# Altium schematic sheet Schematic_3.SchDoc
size A3
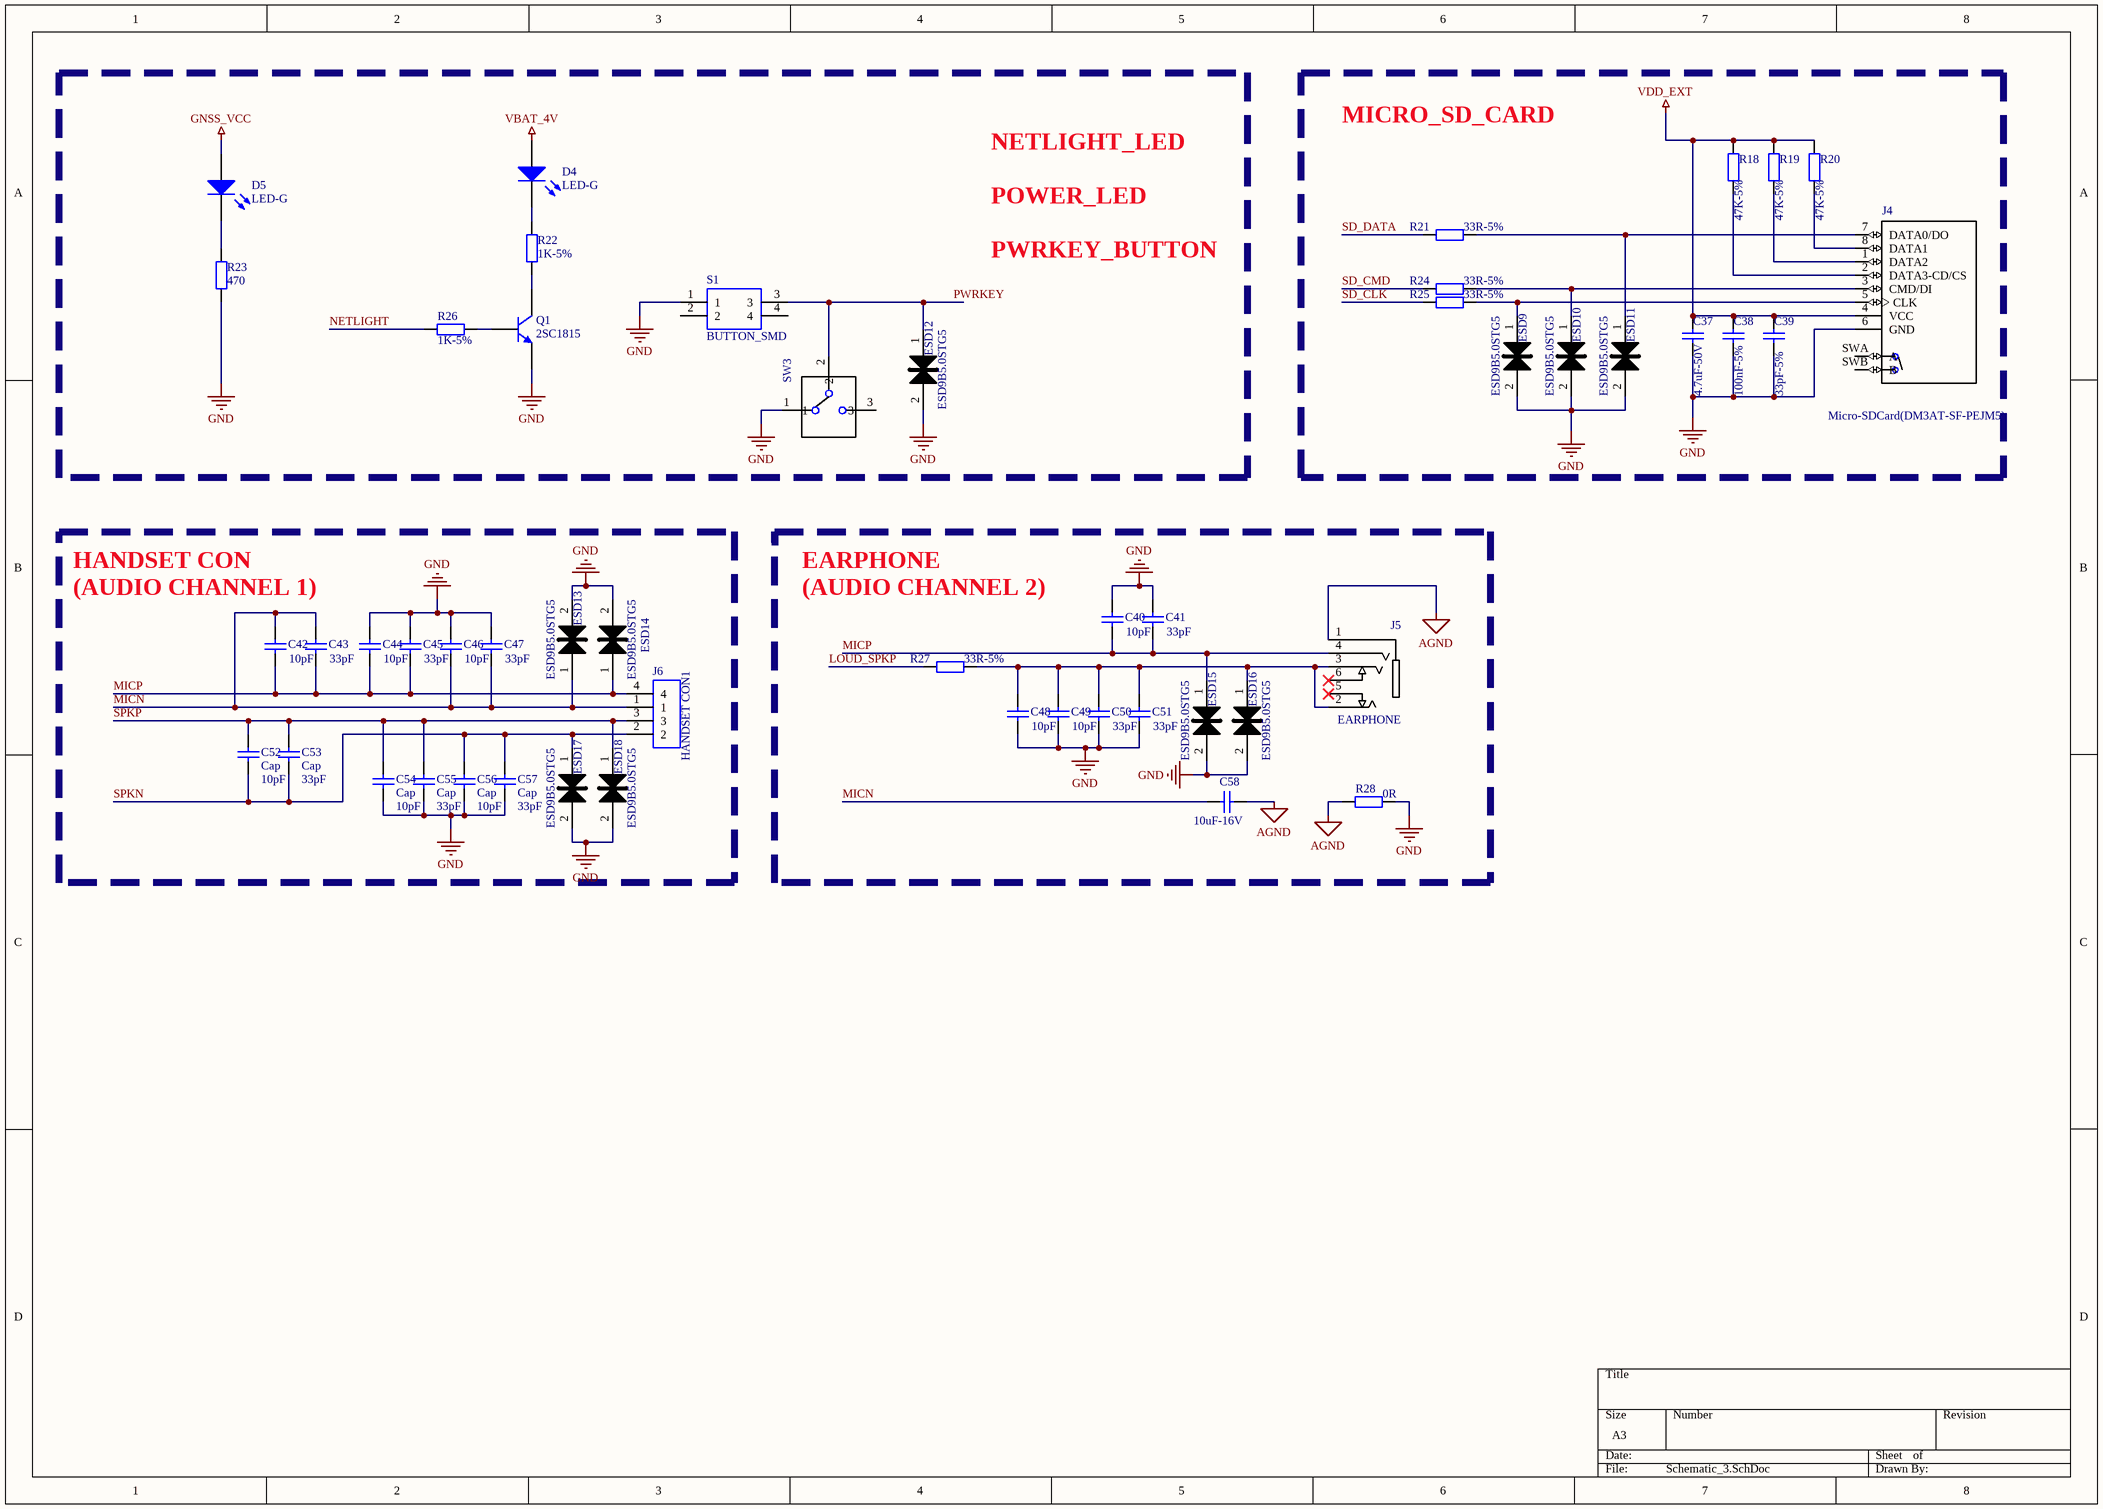
[diagram p0: Schematic_3.SchDoc]

## Parts
C37  value 4.7uF-50V  [C0805]  (hidden comment: Cap)
C38  value 100nF-5%  [C0805]  (hidden comment: Cap)
C39  value 33pF-5%  [C0805]  (hidden comment: Cap)
C40  value 10pF  [C0805]  (hidden comment: Cap)
C41  value 33pF  [C0805]  (hidden comment: Cap)
C42  value 10pF  [C0805]  (hidden comment: Cap)
C43  value 33pF  [C0805]  (hidden comment: Cap)
C44  value 10pF  [C0805]  (hidden comment: Cap)
C45  value 33pF  [C0805]  (hidden comment: Cap)
C46  value 10pF  [C0805]  (hidden comment: Cap)
C47  value 33pF  [C0805]  (hidden comment: Cap)
C48  value 10pF  [C0805]  (hidden comment: Cap)
C49  value 10pF  [C0805]  (hidden comment: Cap)
C50  value 33pF  [C0805]  (hidden comment: Cap)
C51  value 33pF  [C0805]  (hidden comment: Cap)
C52  Cap  value 10pF  [C0805]
C53  Cap  value 33pF  [C0805]
C54  Cap  value 10pF  [C0805]
C55  Cap  value 33pF  [C0805]
C56  Cap  value 10pF  [C0805]
C57  Cap  value 33pF  [C0805]
C58  value 10uF-16V  [C0805]  (hidden comment: Cap)
D4  LED-G  [6-0805_L]
D5  LED-G  [6-0805_L]
ESD9  ESD9B5.0STG5  [ESD9B5.0STG5]
ESD10  ESD9B5.0STG5  [ESD9B5.0STG5]
ESD11  ESD9B5.0STG5  [ESD9B5.0STG5]
ESD12  ESD9B5.0STG5  [ESD9B5.0STG5]
ESD13  ESD9B5.0STG5  [ESD9B5.0STG5]
ESD14  ESD9B5.0STG5  [ESD9B5.0STG5]
ESD15  ESD9B5.0STG5  [ESD9B5.0STG5]
ESD16  ESD9B5.0STG5  [ESD9B5.0STG5]
ESD17  ESD9B5.0STG5  [ESD9B5.0STG5]
ESD18  ESD9B5.0STG5  [ESD9B5.0STG5]
J4  Micro-SDCard(DM3AT-SF-PEJM5)  [SD_CARD]
J5  EARPHONE  [Audio_Jack]
J6  HANDSET CON1  [RJ11-HANDSETCON]
Q1  2SC1815  [SOT23_L]
R18  value 47K-5%  [6-0805_L]  (hidden comment: Res2)
R19  value 47K-5%  [6-0805_L]  (hidden comment: Res2)
R20  value 47K-5%  [6-0805_L]  (hidden comment: Res2)
R21  value 33R-5%  [6-0805_L]  (hidden comment: Res2)
R22  value 1K-5%  [6-0805_L]  (hidden comment: Res2)
R23  value 470  [6-0805_L]  (hidden comment: Res2)
R24  value 33R-5%  [6-0805_L]  (hidden comment: Res2)
R25  value 33R-5%  [6-0805_L]  (hidden comment: Res2)
R26  value 1K-5%  [6-0805_L]  (hidden comment: Res2)
R27  value 33R-5%  [6-0805_L]  (hidden comment: Res2)
R28  value 0R  [6-0805_L]  (hidden comment: Res2)
S1  BUTTON_SMD  [BUTTON_4PINS_SMD_3D]
SW3  DIP-SLIDE-SWITCH(3P-11.6X4.0X5.4+2.0MM)  [SLIDE_SWITCH_3PINS]  (value not drawn)

## Nets
AGND: C58.2 J5.1(SLEEVE) R28.1
GND: C37.1 C38.1 C39.2 C40.1 C41.1 C44.2 C45.2 C46.2 C47.2 C48.1 C49.1 C50.1 C51.1 C54.1 C55.1 C56.1 C57.1 ESD9.2(K) ESD10.2(K) ESD11.2(K) ESD12.2(K) ESD13.2(K) ESD14.2(K) ESD15.2(K) ESD16.2(K) ESD17.2(K) ESD18.2(K) J4.6(GND) Q1.1(E) R23.2 R28.2 S1.1 SW3.1
GNSS_VCC: D5.1(A)
VBAT_4V: D4.1(A)
VDD_EXT: C37.2 C38.2 C39.1 J4.4(VCC) R18.2 R19.2 R20.2
LOUD_SPKP: R27.1
MICN: C42.2 C43.2 C46.1 C47.1 C58.1 ESD13.1(A) J6.1
MICP: C40.2 C41.2 C42.1 C43.1 C44.1 C45.1 ESD14.1(A) ESD15.1(A) J5.4(RING2) J6.4
NETLIGHT: R26.2
PWRKEY: ESD12.1(A) S1.3 SW3.2
SD_CLK: R25.1
SD_CMD: R24.1
SD_DATA: R21.1
SPKN: C52.1 C53.1 C56.2 C57.2 ESD17.1(A) J6.2
SPKP: C52.2 C53.2 C54.2 C55.2 ESD18.1(A) J6.3
NetC48_2: C48.2 C49.2 C50.2 C51.2 ESD16.1(A) J5.2(TIP) J5.3(RING1) R27.2
NetD4_2: D4.2(K) R22.1
NetD5_2: D5.2(K) R23.1
NetESD9_1: ESD9.1(A) J4.5(CLK) R25.2
NetESD10_1: ESD10.1(A) J4.3(CMD/DI) R24.2
NetESD11_1: ESD11.1(A) J4.7(DATA0/DO) R21.2
NetJ4_1: J4.1(DATA2) R19.1
NetJ4_2: J4.2(DATA3-CD/CS) R18.1
NetJ4_8: J4.8(DATA1) R20.1
NetQ1_2: Q1.2(B) R26.1
NetQ1_3: Q1.3(C) R22.2

Not connected (* = marked no-connect by the designer): J4 SWA(A) SWB(B); J5 5(TIP_SWITCH)* 6(RING1_SWITCH)*; S1 2 4; SW3 3

## Notes on the sheet
- MICRO_SD_CARD
- NETLIGHT_LED
  POWER_LED
  PWRKEY_BUTTON
- HANDSET CON
  (AUDIO CHANNEL 1)
- EARPHONE
  (AUDIO CHANNEL 2)

## Library data of the parts
C37-C58 = Cap: Capacitor; Published: 8-Jun-2000; LatestRevisionDate: 17-Jul-2002; LatestRevisionNote: Re-released for DXP Platform.; PackageReference: RAD-0.3; Publisher: Altium Limited; PackageDescription: Radial Cap, Thru-Hole; 2 Leads; 0.3 in Pin Spacing
D4 D5 = LED0: Typical INFRARED GaAs LED; Published: 8-Jun-2000; LatestRevisionDate: 08-Jul-2005; LatestRevisionNote: Mech Layer 1 removed.; PackageReference: LED-0; Publisher: Altium Limited; PackageDescription: LED; 2 Leads
ESD9-ESD18 = 1
J4 = DM3AT-SF-PEJM5: DM3 RA SMT microSD memory card push/push; MF: Hirose; MP: DM3AT-SF-PEJM5; Package: None; Availability: Warning; Price: 2.58 USD; SnapEDA_Link: https://www.snapeda.com/parts/DM3AT-SF-PEJM5/Hirose%20Electric%20Co%20Ltd/view-part/?ref=snap; Value: *
J5 = SJ-43504-SMT-TR: audio jack, 3.5 mm, rt, 4 conductor, mid mount SMT, 2 switches, T/R package; MF: CUI; Availability: Good; Price: 0.85 USD; Package: None; MP: SJ-43504-SMT-TR; SnapEDA_Link: https://www.snapeda.com/parts/SJ-43504-SMT-TR/CUI%20Inc/view-part/?ref=snap; Value: *
J6 = 95009-7441: RJ11 R/A PCB modular jack, w/panel stops Molex 4P4C Right Angle PCB Mount RJ11 Modular Jack Connector 95009; Allied_Number: 70747073; Manufacturer_Name: Molex; Manufacturer_Part_Number: 95009-7441; RS Part Number: 8967548; RS Price/Stock: http://uk.rs-online.com/web/p/products/8967548; Allied Price/Stock: http://www.alliedelec.com/molex-incorporated-95009-7441/70747073/; Arrow Part Number: 95009-7441; Arrow Price/Stock: http://uk.rs-online.com/web/p/products/8967548; Datasheet Link: http://www.molex.com/pdm_docs/sd/950097441_sd.pdf
Q1 = 2N3904: NPN General Purpose Amplifier; Published: 8-Jun-2000; LatestRevisionDate: 15-Jan-2003; LatestRevisionNote: PCB Footprint 'BCY-W3/D4.7' replaced; DatasheetVersion: 1997; PackageVersion: Sep-1998; PackageReference: TO-92A; Publisher: Altium Limited; PackageDescription: TO, Flat Index; 3 In-Line, Axial Leads; Body Dia. 4.5mm; Leads 0.51 x 0.48 mm (max); ComponentLink1Description: Manufacturer Link; ComponentLink1URL: http://www.fairchildsemi.com/; ComponentLink2Description: Datasheet; ComponentLink2URL: http://www.fairchildsemi.com/ds/2N%2F2N3904.pdf
R18-R28 = Res2: Resistor; Published: 8-Jun-2000; LatestRevisionDate: 17-Jul-2002; LatestRevisionNote: Re-released for DXP Platform.; PackageReference: AXIAL-0.4; Publisher: Altium Limited; PackageDescription: Axial Device, Thru-Hole; 2 Leads; 0.4 in Pin Spacing
S1 = 4-1437565-1: 6x6mm SMD tactile switch,5mm H 1.6N Black Button Tactile Switch, SPST-NO 0.05 A@ 12 V dc 1.4mm; Manufacturer_Name: TE Connectivity; Allied_Number: R1117787; Manufacturer_Part_Number: 4-1437565-1; RS Part Number: 1616046; RS Price/Stock: http://uk.rs-online.com/web/p/products/1616046; Allied Price/Stock: http://www.alliedelec.com/te-connectivity-4-1437565-1/R1117787/; Arrow Part Number: 4-1437565-1; Arrow Price/Stock: https://www.arrow.com/en/products/4-1437565-1/te-connectivity; Datasheet Link: http://docs-europe.electrocomponents.com/webdocs/14a3/0900766b814a3369.pdf
SW3 = DIP-SLIDE-SWITCH(3P-11.6X4.0X5.4+2.0MM): EG Series SPDT On-On Vertical Through Hole Slide Switch; MP: EG1218; Availability: Good; MF: E-Switch; Package: FakePackage u; Price: 0.41 USD; SnapEDA_Link: https://www.snapeda.com/symbols-footprints/EG1218/E-Switch/view-part/?ref=snap; Value: *